# Altium schematic sheet BUCK.SchDoc
size A4
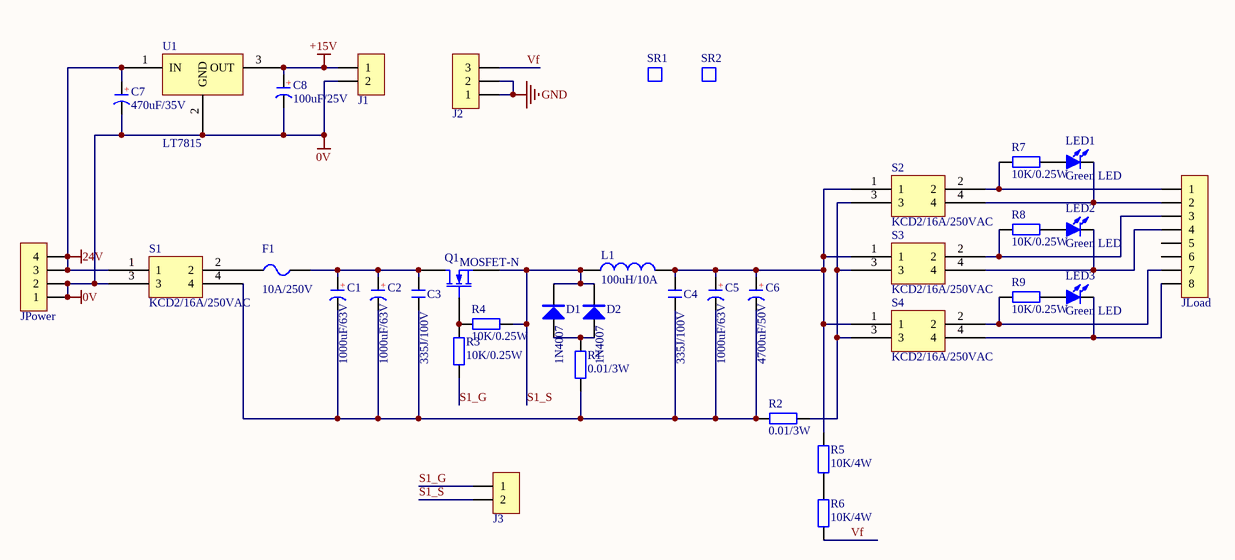
[diagram p0: BUCK.SchDoc]

## Parts
C1  1000uF/63V  [CAP 1.5*4*8]
C2  1000uF/63V  [CAP 1.5*4*8]
C3  335J/100V  [C 0805]
C4  335J/100V  [C 0805]
C5  1000uF/63V  [CAP 1.5*4*8]
C6  4700uF/50V  [CAP 1.5*4*8]
C7  470uF/35V  [CAP 1.5*4*8]
C8  100uF/25V  [CAP 1.5*4*8]
D1  1N4007  [DO-41]
D2  1N4007  [DO-41]
F1  10A/250V  [FU 5x20]
J1  HDR-1X2  [PH2.0 D-L-2P]  (value not drawn)
J2  HDR-1X3  [PH2.0 D-L-3P]  (value not drawn)
J3  HDR-1X2  [PH2.0 D-L-2P]  (value not drawn)
JLoad  HDR-1X8  [KF2EDGK5.08-8P]  (value not drawn)
JPower  HDR-1X4  [PH2.0 D-L-4P]  (value not drawn)
L1  100uH/10A  [L 0805]
LED1  Green LED  [LED 0805G]
LED2  Green LED  [LED 0805G]
LED3  Green LED  [LED 0805G]
Q1  MOSFET-N  [TO220A]
R1  0.01/3W  [R 0805]
R2  0.01/3W  [R 0805]
R3  10K/0.25W  [R 0805]
R4  10K/0.25W  [R 0805]
R5  10K/4W  [R 0805]
R6  10K/4W  [R 0805]
R7  10K/0.25W  [R 0805]
R8  10K/0.25W  [R 0805]
R9  10K/0.25W  [R 0805]
S1  KCD2/16A/250VAC  [KCD1-104-W]
S2  KCD2/16A/250VAC  [KCD1-104-W]
S3  KCD2/16A/250VAC  [KCD1-104-W]
S4  KCD2/16A/250VAC  [KCD1-104-W]
SR1  散热片  [散热片]  (value not drawn)
SR2  散热片  [散热片]  (value not drawn)
U1  LT7815  [TO220A]

## Nets
0V: C7.2(K) C8.2(K) J1.2 JPower.1 JPower.2 S1.3 U1.2(GND)
24V: C7.1(A) JPower.3 JPower.4 S1.1 U1.1(IN)
+15V: C8.1(A) J1.1 U1.3(OUT)
GND: J2.1 J2.2
S1_G: J3.1 R3.2
S1_S: D1.2(K) D2.2(K) J3.2 L1.1 Q1.3(S) R4.2
Vf: J2.3 R6.1
NetC1_1: C1.1(A) C2.1(A) C3.1 F1.1 Q1.1(D)
NetC1_2: C1.2(K) C2.2(K) C3.2 C4.2 C5.2(K) C6.2(K) R1.1 R2.2 S1.4
NetC4_1: C4.1 C5.1(A) C6.1(A) L1.2 R5.2 S2.1 S3.1 S4.1
NetD1_1: D1.1(A) D2.1(A) R1.2
NetF1_2: F1.2 S1.2
NetJLoad_1: JLoad.1 R7.2 S2.2
NetJLoad_2: JLoad.2 LED1.2(K) S2.4
NetJLoad_3: JLoad.3 R8.2 S3.2
NetJLoad_4: JLoad.4 LED2.2(K) S3.4
NetJLoad_7: JLoad.7 R9.2 S4.2
NetJLoad_8: JLoad.8 LED3.2(K) S4.4
NetLED1_1: LED1.1(A) R7.1
NetLED2_1: LED2.1(A) R8.1
NetLED3_1: LED3.1(A) R9.1
NetQ1_2: Q1.2(G) R3.1 R4.1
NetR2_1: R2.1 S2.3 S3.3 S4.3
NetR5_1: R5.1 R6.2

Not connected (* = marked no-connect by the designer): JLoad 5 6

## Notes on the sheet
- (in symbol C-CAP) +

## Library data of the parts
C1 C2 C5-C8 = C-CAP: 直插电解电容; 版权归属: 源创客; BOM名称: 直插电解电容; 学习资源: www.ooocke.com
C3 C4 = C: 无极性贴片电容; 版权归属: 源创客; BOM名称: 无极性贴片电容; 学习资源: www.ooocke.com
D1 D2 = 1N4007: 整流二极管; 版权归属: 源创客; BOM名称: 整流二极管; 学习资源: www.ooocke.com
F1 = FU 5x20: 5*20保险丝; 版权归属: 源创客; BOM名称: 5*20保险丝; 学习资源: www.ooocke.com
J1 J3 = Header 2: 2P接插件; 版权归属: 源创客; BOM名称: 2P接插件; 学习资源: www.ooocke.com
J2 = Header 3: 3P接插件; 版权归属: 源创客; BOM名称: 3P接插件; 学习资源: www.ooocke.com
JLoad = Header 8: 8P接插件; 版权归属: 源创客; BOM名称: 8P接插件; 学习资源: www.ooocke.com
JPower = Header 4: 4P接插件; 版权归属: 源创客; BOM名称: 4P接插件; 学习资源: www.ooocke.com
L1 = L: 小功率贴片电感; 版权归属: 源创客; BOM名称: 小功率贴片电感; 学习资源: www.ooocke.com
LED1-LED3 = LED-SMD: 贴片LED; 版权归属: 源创客; BOM名称: 贴片LED; 学习资源: www.ooocke.com
Q1 = MOSFET-N: N-Channel MOSFET; Published: 8-Jun-2000; LatestRevisionDate: 17-Jul-2002; LatestRevisionNote: Re-released for DXP Platform.; PackageVersion: 1995/1996; PackageReference: E3; Publisher: Altium Limited; PackageDescription: TO, Flat Index; 3 In-Line, Axial Leads; Body Dia. 4.6mm; Lead Dia. 0.5 mm (max)
R1-R9 = R: 贴片电阻; 版权归属: 源创客; BOM名称: 贴片电阻; 学习资源: www.ooocke.com
SR1 SR2 = S1: 版权归属: 源创客; BOM名称: 散热片; 学习资源: www.ooocke.com